# EAGLE design sigtest (EAGLE 9.6.2)
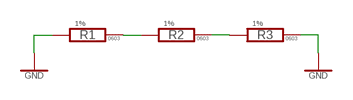
[diagram p0: schematic, sheet 1]

## Parts
R1  R-1%-0603  [R0603]
R2  R-1%-0603  [R0603]
R3  R-1%-0603  [R0603]

## Nets
GND: R1.2 R3.1
N$1: R1.1 R2.2
N$2: R2.1 R3.2

## Library data of the parts
R1-R3 = rc:R; PACKAGE: 0603; RU: Резистор SMD 0603; TOLERANCE: 1%

## Board
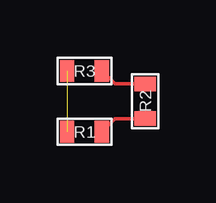
[diagram p1: board, top side]

No outline drawn. Coordinates in mm, seen from the top.
Copper layers (1*16): Top 0.035mm / dielectric 1.5mm / Bottom 0.035mm
Design rules "default": minimum track width 6mil, minimum drill 0.35mm, track to track 6mil, track to pad 6mil, pad to pad 6mil, via to via 6mil, smd to smd 6mil, copper to edge 40mil, drill to drill 6mil, minimum pad ring 10mil, minimum via ring 8mil, stop-mask expansion 4mil, vias tented up to drill 0mil, thermal gap 10mil

### Footprints (pad centres in the part's own frame; a part is rotated, then mirrored left to right if it is on the bottom)
R0603 = smd 0.6 x 0.9: 1 -0.725,0; 2 0.725,0

### Placement (x,y rotation side)
R1  2.54,2.54 180 top
R2  5.08,3.81 270 top
R3  2.54,5.08 0 top

### Tracks (layer width: path | path; a pad name or v marks a point on that pad's centre or on a via)
GND  (1 unrouted)
N$1
  Top 0.152: R1.1 3.81,3.08 R2.2
N$2
  Top 0.152: R3.2 3.81,4.54 R2.1